# Altium schematic sheet schema1.SchDoc
size A4
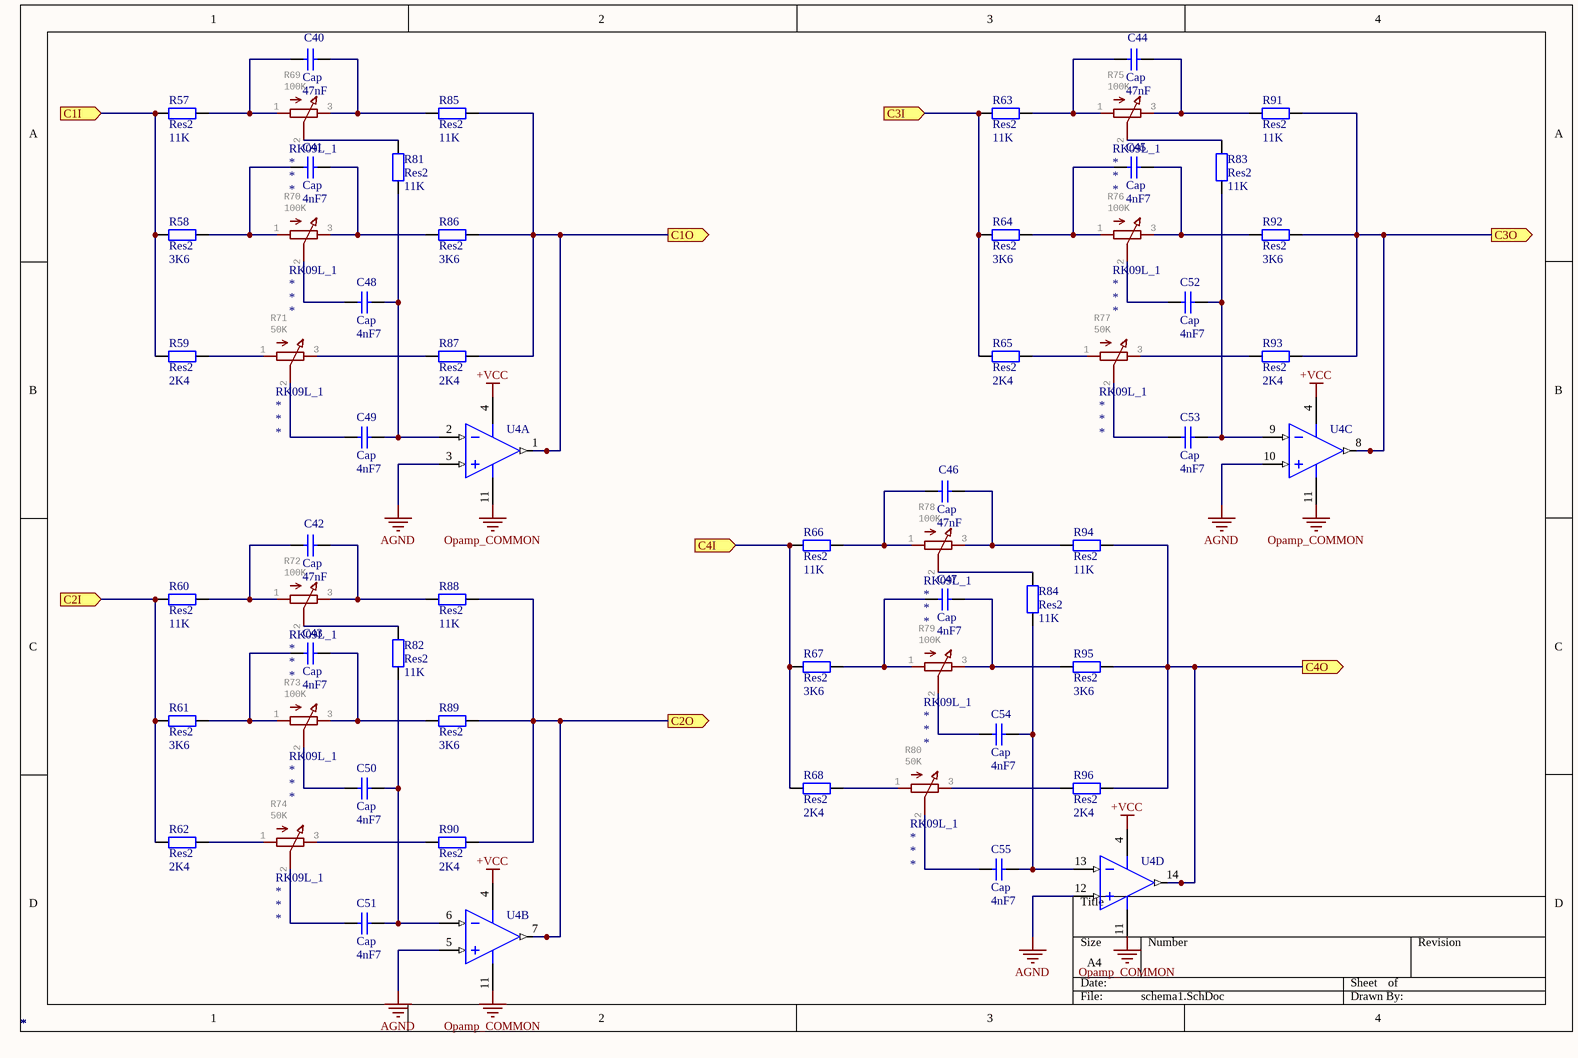
[diagram p0: schema1.SchDoc]

## Parts
C40  Cap  value 47nF  [SMD_CAPACITOR]
C41  Cap  value 4nF7  [SMD_CAPACITOR]
C42  Cap  value 47nF  [SMD_CAPACITOR]
C43  Cap  value 4nF7  [SMD_CAPACITOR]
C44  Cap  value 47nF  [SMD_CAPACITOR]
C45  Cap  value 4nF7  [SMD_CAPACITOR]
C46  Cap  value 47nF  [SMD_CAPACITOR]
C47  Cap  value 4nF7  [SMD_CAPACITOR]
C48  Cap  value 4nF7  [SMD_CAPACITOR]
C49  Cap  value 4nF7  [SMD_CAPACITOR]
C50  Cap  value 4nF7  [SMD_CAPACITOR]
C51  Cap  value 4nF7  [SMD_CAPACITOR]
C52  Cap  value 4nF7  [SMD_CAPACITOR]
C53  Cap  value 4nF7  [SMD_CAPACITOR]
C54  Cap  value 4nF7  [SMD_CAPACITOR]
C55  Cap  value 4nF7  [SMD_CAPACITOR]
R57  Res2  value 11K  [SMD_RESISTOR]
R58  Res2  value 3K6  [SMD_RESISTOR]
R59  Res2  value 2K4  [SMD_RESISTOR]
R60  Res2  value 11K  [SMD_RESISTOR]
R61  Res2  value 3K6  [SMD_RESISTOR]
R62  Res2  value 2K4  [SMD_RESISTOR]
R63  Res2  value 11K  [SMD_RESISTOR]
R64  Res2  value 3K6  [SMD_RESISTOR]
R65  Res2  value 2K4  [SMD_RESISTOR]
R66  Res2  value 11K  [SMD_RESISTOR]
R67  Res2  value 3K6  [SMD_RESISTOR]
R68  Res2  value 2K4  [SMD_RESISTOR]
R69  value 100K  [RK09L1140A65]
R70  value 100K  [RK09L1140A65]
R71  value 50K  [RK09L1140A65]
R72  value 100K  [RK09L1140A65]
R73  value 100K  [RK09L1140A65]
R74  value 50K  [RK09L1140A65]
R75  value 100K  [RK09L1140A65]
R76  value 100K  [RK09L1140A65]
R77  value 50K  [RK09L1140A65]
R78  value 100K  [RK09L1140A65]
R79  value 100K  [RK09L1140A65]
R80  value 50K  [RK09L1140A65]
R81  Res2  value 11K  [SMD_RESISTOR]
R82  Res2  value 11K  [SMD_RESISTOR]
R83  Res2  value 11K  [SMD_RESISTOR]
R84  Res2  value 11K  [SMD_RESISTOR]
R85  Res2  value 11K  [SMD_RESISTOR]
R86  Res2  value 3K6  [SMD_RESISTOR]
R87  Res2  value 2K4  [SMD_RESISTOR]
R88  Res2  value 11K  [SMD_RESISTOR]
R89  Res2  value 3K6  [SMD_RESISTOR]
R90  Res2  value 2K4  [SMD_RESISTOR]
R91  Res2  value 11K  [SMD_RESISTOR]
R92  Res2  value 3K6  [SMD_RESISTOR]
R93  Res2  value 2K4  [SMD_RESISTOR]
R94  Res2  value 11K  [SMD_RESISTOR]
R95  Res2  value 3K6  [SMD_RESISTOR]
R96  Res2  value 2K4  [SMD_RESISTOR]
U4  OPA1664AIDR  [OPA1664AIDR]  (value not drawn)  (parts A,B,C,D of 4)

## Ports
C1I (in), C1O (out), C2I (in), C2O (out), C3I (in), C3O (out), C4I (in), C4O (out)

## Nets
+VCC: U4.4(V+)
AGND: U4.3(IN_A+) U4.5(IN_B+) U4.10(IN_C+) U4.12(IN_D+)
Opamp_COMMON: U4.11(V-)
C1I: R57.1 R58.1 R59.1 ; port C1I
C1O: R85.2 R86.2 R87.2 U4.1(OUT_A) ; port C1O
C2I: R60.1 R61.1 R62.1 ; port C2I
C2O: R88.2 R89.2 R90.2 U4.7(OUT_B) ; port C2O
C3I: R63.1 R64.1 R65.1 ; port C3I
C3O: R91.2 R92.2 R93.2 U4.8(OUT_C) ; port C3O
C4I: R66.1 R67.1 R68.1 ; port C4I
C4O: R94.2 R95.2 R96.2 U4.14(OUT_D) ; port C4O
NetC40_1: C40.1 R57.2 R69.1
NetC40_2: C40.2 R69.3 R85.1
NetC41_1: C41.1 R58.2 R70.1
NetC41_2: C41.2 R70.3 R86.1
NetC42_1: C42.1 R60.2 R72.1
NetC42_2: C42.2 R72.3 R88.1
NetC43_1: C43.1 R61.2 R73.1
NetC43_2: C43.2 R73.3 R89.1
NetC44_1: C44.1 R63.2 R75.1
NetC44_2: C44.2 R75.3 R91.1
NetC45_1: C45.1 R64.2 R76.1
NetC45_2: C45.2 R76.3 R92.1
NetC46_1: C46.1 R66.2 R78.1
NetC46_2: C46.2 R78.3 R94.1
NetC47_1: C47.1 R67.2 R79.1
NetC47_2: C47.2 R79.3 R95.1
NetC48_1: C48.1 R70.2
NetC48_2: C48.2 C49.2 R81.1 U4.2(IN_A-)
NetC49_1: C49.1 R71.2
NetC50_1: C50.1 R73.2
NetC50_2: C50.2 C51.2 R82.1 U4.6(IN_B-)
NetC51_1: C51.1 R74.2
NetC52_1: C52.1 R76.2
NetC52_2: C52.2 C53.2 R83.1 U4.9(IN_C-)
NetC53_1: C53.1 R77.2
NetC54_1: C54.1 R79.2
NetC54_2: C54.2 C55.2 R84.1 U4.13(IN_D-)
NetC55_1: C55.1 R80.2
NetR59_2: R59.2 R71.1
NetR62_2: R62.2 R74.1
NetR65_2: R65.2 R77.1
NetR68_2: R68.2 R80.1
NetR69_2: R69.2 R81.2
NetR71_3: R71.3 R87.1
NetR72_2: R72.2 R82.2
NetR74_3: R74.3 R90.1
NetR75_2: R75.2 R83.2
NetR77_3: R77.3 R93.1
NetR78_2: R78.2 R84.2
NetR80_3: R80.3 R96.1

## Library data of the parts
C40-C55 = Cap: Capacitor; Published: 8-Jun-2000; LatestRevisionDate: 17-Jul-2002; LatestRevisionNote: Re-released for DXP Platform.; PackageReference: RAD-0.3; Publisher: Altium Limited; PackageDescription: Radial Cap, Thru-Hole; 2 Leads; 0.3 in Pin Spacing
R57-R68 R81-R96 = Res2: Resistor; Published: 8-Jun-2000; LatestRevisionDate: 17-Jul-2002; LatestRevisionNote: Re-released for DXP Platform.; PackageReference: AXIAL-0.4; Publisher: Altium Limited; PackageDescription: Axial Device, Thru-Hole; 2 Leads; 0.4 in Pin Spacing
R69-R80 = RK09L_1: GateName_1: G$1; SymbolName_1: POT_EU-; DeviceSetName: RK09L; LibraryName: SD_Pots
U4 = CMP-0272-00211-3: Sound Plus Low-Power, Low-Noise and Distortion, Audio Operational Amplifier, 3 to 36 V, -40 to 85 degC, 14-pin SOIC (D14), Green (RoHS & no Sb/Br); Manufacturer: Texas Instruments; Iq per channel(Max)(mA): 1.5; IIB(Max)(pA): 1200000; Offset Drift(Typ)(uV/C): 2; Total Supply Voltage(Max)(+5V is 5, +/-5V is 10): 36; Rating: Catalog; Packing: LARGE T&R; Slew Rate(Typ)(V/us): 17; CMRR(Min)(dB): 106; Total Supply Voltage(Min)(+5V is 5, +/-5V is 10): 3; Sub Family: Audio Operational Amplifier, High Supply Voltage Amplifier (>=30V), Low Noise Amp (<=10nV/rtHz), Precision Amplifier; GBW(Typ)(MHz): 22; Number of Channels: 4; Code_JEDEC: MS-012; PartNumber: OPA1664AIDR; ComponentLink2Description: Datasheet; ComponentLink3URL: http://www.ti.com/lit/ml/mpds177g/mpds177g.pdf; PackageVersion: 4040047-5/M, 06/2011; ComponentLink1Description: Manufacturer URL; DatasheetVersion: SBOS489; Mounting Technology: Surface Mount; Vio (25C)(Max)(mV): 1.5; PackageReference: D0014A; ComponentLink1URL: http://www.ti.com/; ComponentLink2URL: http://www.ti.com/lit/ds/symlink/opa1664.pdf; Eco-Plan: Green (RoHS & no Sb/Br); PackageDescription: 14-Pin Plastic Small Outline, Body 8.65 x 3.9 mm, Pitch 1.27 mm; ComponentLink3Description: Package Specification